# EAGLE schematic Shutdown Circuit (EAGLE 8.4.1)
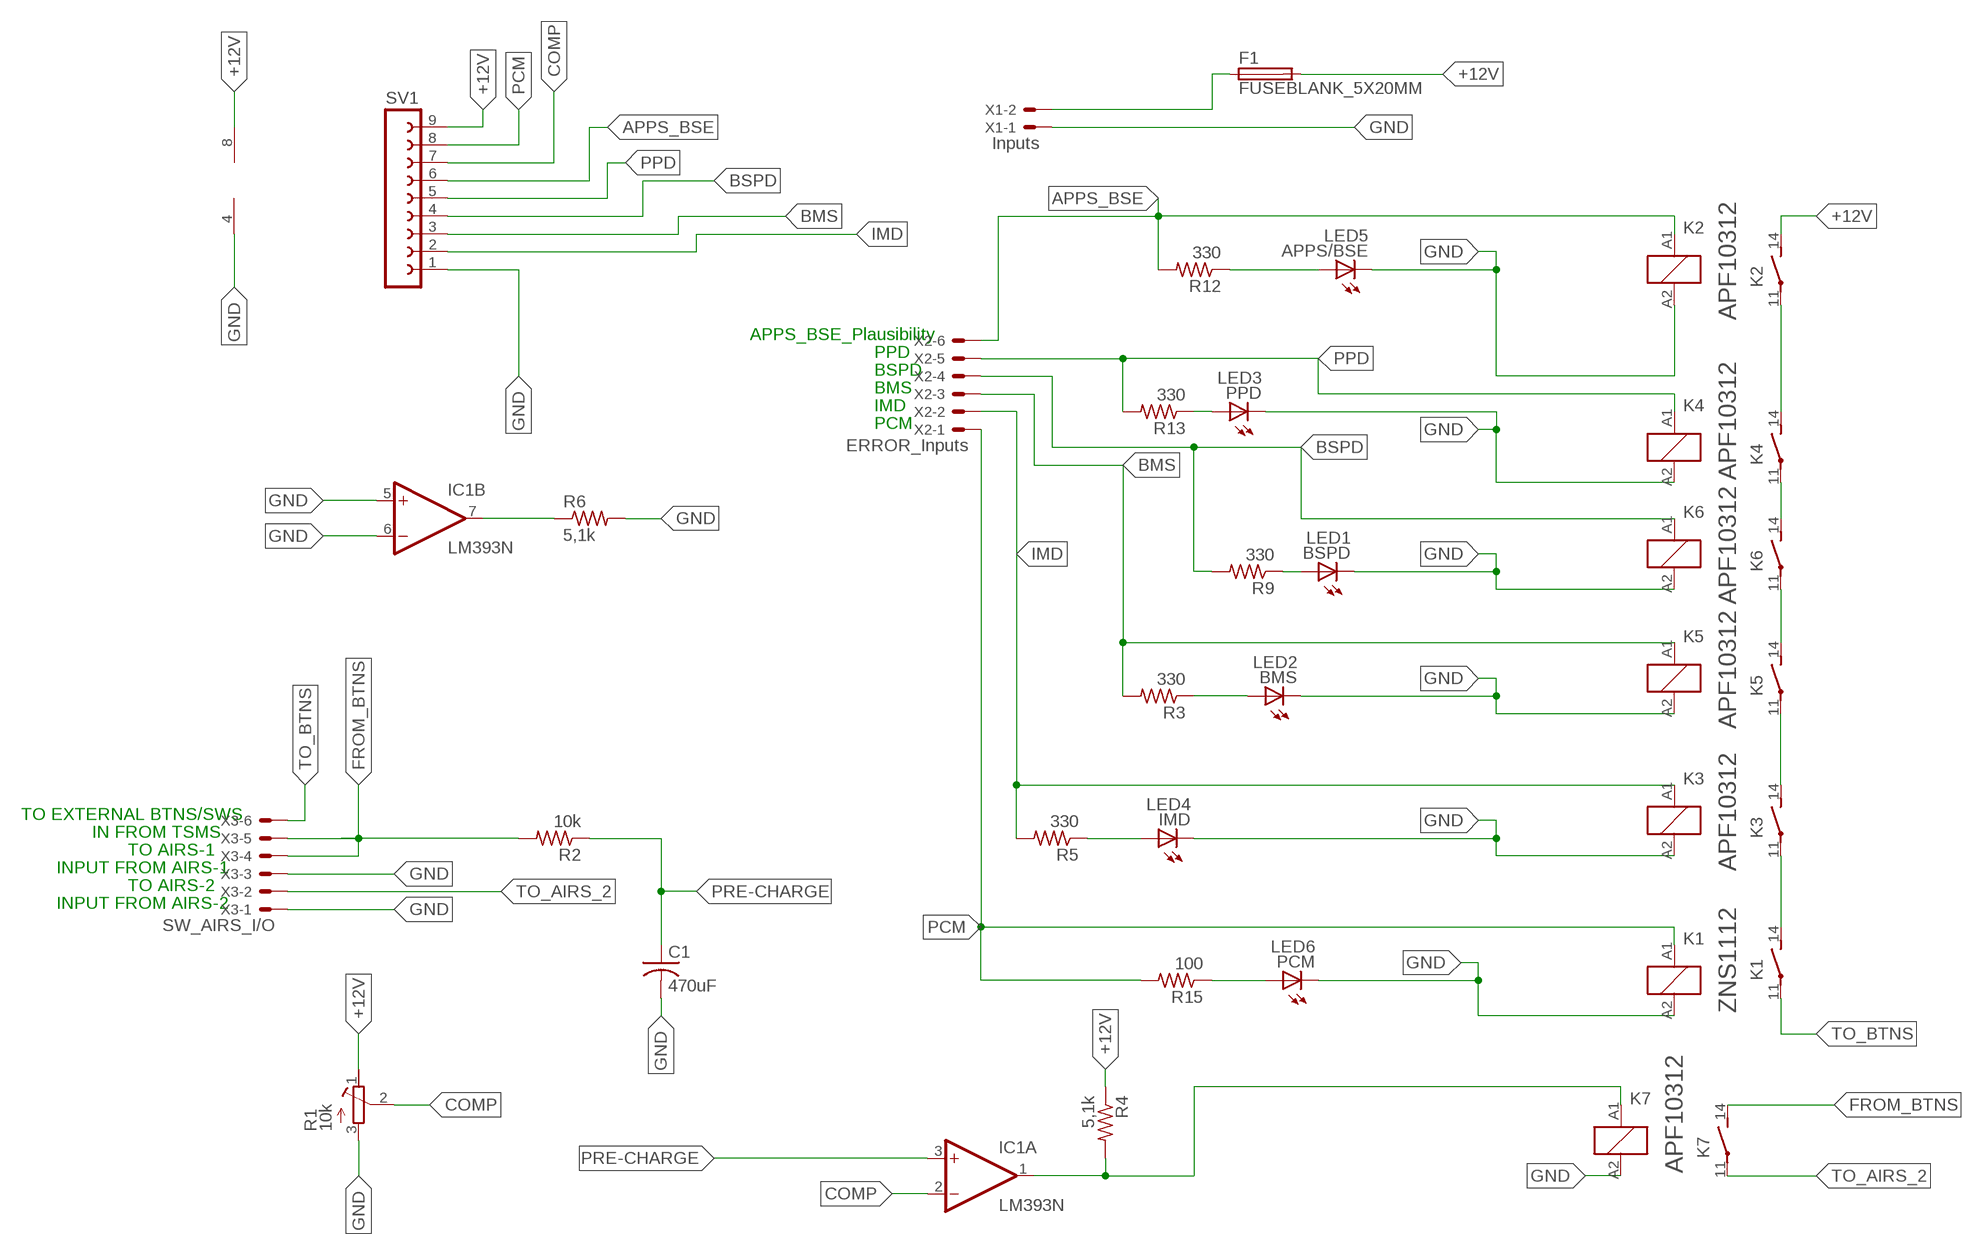
[diagram p0: schematic, sheet 1]

## Parts
APPS/BSE  LED5  LED3MM  [LED3MM]
BMS  LED2  LED3MM  [LED3MM]
BSPD  LED1  LED3MM  [LED3MM]
C1  470uF  C-US050-045X075  [C050-045X075]
F1  FUSEBLANK_5X20MM  [FUSE_HOLDER_5X20MM]
IC1  LM393N  [DIL08]
IMD  LED4  LED3MM  [LED3MM]
K1  ZNS1112  [ZN1]
K2  APF10312  SNR1  [SNR-V1]
K3  APF10312  SNR1  [SNR-V1]
K4  APF10312  SNR1  [SNR-V1]
K5  APF10312  SNR1  [SNR-V1]
K6  APF10312  SNR1  [SNR-V1]
K7  APF10312  SNR1  [SNR-V1]
PCM  LED6  LED3MM  [LED3MM]
PPD  LED3  LED3MM  [LED3MM]
R1  10k  R-TRIMM43P  [RTRIM43P]
R2  10k  R-US_0207/10  [0207/10]
R3  330  R-US_0207/10  [0207/10]
R4  5,1k  R-US_0207/10  [0207/10]
R5  330  R-US_0207/10  [0207/10]
R6  5,1k  R-US_0207/10  [0207/10]
R9  330  R-US_0207/10  [0207/10]
R12  330  R-US_0207/10  [0207/10]
R13  330  R-US_0207/10  [0207/10]
R15  100  R-US_0207/10  [0207/10]
SV1  FE09W  [FE09W]
X1  Inputs  22-23-2021  [22-23-2021]
X2  ERROR_Inputs  22-23-2061  [22-23-2061]
X3  SW_AIRS_I/O  22-23-2061  [22-23-2061]

## Nets
+12V: F1.2 IC1.8(P:V+) K2.14(2:S) R1.1(E) R4.1 SV1.9
APPS_BSE: K2.A1 R12.2 SV1.6 X2.6
BMS: K5.A1 R3.2 SV1.3 X2.3
BSPD: K6.A1 R9.2 SV1.4 X2.4
COMP: IC1.2(A:-IN) R1.2(S) SV1.7
FROM_BTNS: K7.14(2:S) R2.2 X3.4 X3.5
GND: APPS/BSE.K(C) BMS.K(C) BSPD.K(C) C1.2 IC1.4(P:V-) IC1.5(B:+IN) IC1.6(B:-IN) IMD.K(C) K1.A2 K2.A2 K3.A2 K4.A2 K5.A2 K6.A2 K7.A2 PCM.K(C) PPD.K(C) R1.3(A) R6.2 SV1.1 X1.1 X3.1 X3.3
IMD: K3.A1 R5.2 SV1.2 X2.2
N$1: IC1.1(A:OUT) K7.A1 R4.2
N$6: K2.11(2:P) K4.14(2:S)
N$7: K4.11(2:P) K6.14(2:S)
N$8: IC1.7(B:OUT) R6.1
N$9: K5.14(2:S) K6.11(2:P)
N$10: F1.1 X1.2
N$12: K3.14(2:S) K5.11(2:P)
N$13: K1.14(2:S) K3.11(2:P)
N$24: APPS/BSE.A R12.1
N$25: BSPD.A R9.1
N$29: PPD.A R13.1
N$31: BMS.A R3.1
N$33: IMD.A R5.1
N$35: PCM.A R15.1
PCM: K1.A1 R15.2 SV1.8 X2.1
PPD: K4.A1 R13.2 SV1.5 X2.5
PRE-CHARGE: C1.1 IC1.3(A:+IN) R2.1
TO_AIRS_2: K7.11(2:P) X3.2
TO_BTNS: K1.11(2:P) X3.6

## Notes on the sheet
- APPS_BSE_Plausibility
- PPD
- BSPD
- BMS
- IMD
- PCM
- TO EXTERNAL BTNS/SWS
- IN FROM TSMS
- TO AIRS-1
- INPUT FROM AIRS-1
- TO AIRS-2
- INPUT FROM AIRS-2

## Library data of the parts
APPS/BSE BMS BSPD IMD PCM PPD = led:LED: LED OSRAM: - CHIPLED LG R971, LG N971, LY N971, LG Q971, LY Q971, LO R971, LY R971 LH N974, LH R974 LS Q976, LO Q976, LY Q976 LO Q996 - Hyper CHIPLED LW Q18S LB Q993, LB Q99A, LB R99A - SideLED LS A670, LO A670, LY A670, LG A670, LP A670 LB A673, LV A673, LT A673, LW A673 LH A674 LY A675 LS A676, LA A676, LO A676, LY A676, LW A676 LS A679, LY A679, LG A679 - Hyper Micro SIDELED® LS Y876, LA Y876, LO Y876, LY Y876 LT Y87S - SmartLED LW L88C, LW L88S LB L89C, LB L89S, LG L890 LS L89K, LO L89K, LY L89K LS L896, LA L896, LO L896, LY L896 - TOPLED LS T670, LO T670, LY T670, LG T670, LP T670 LSG T670, LSP T670, LSY T670, LOP T670, LYG T670 LG T671, LOG T671, LSG T671 LB T673, LV T673, LT T673, LW T673 LH T674 LS T676, LA T676, LO T676, LY T676, LB T676, LH T676, LSB T676, LW T676 LB T67C, LV T67C, LT T67C, LS T67K, LO T67K, LY T67K, LW E67C LS E67B, LA E67B, LO E67B, LY E67B, LB E67C, LV E67C, LT E67C LW T67C LS T679, LY T679, LG T679 LS T770, LO T770, LY T770, LG T770, LP T770 LB T773, LV T773, LT T773, LW T773 LH T774 LS E675, LA E675, LY E675, LS T675 LS T776, LA T776, LO T776, LY T776, LB T776 LHGB T686 LT T68C, LB T68C - Hyper Mini TOPLED® LB M676 - Mini TOPLED Santana® LG M470 LS M47K, LO M47K, LY M47K Source: http://www.osram.convergy.de LUXEON: - LUMILED® LXK2-PW12-R00, LXK2-PW12-S00, LXK2-PW14-U00, LXK2-PW14-V00 LXK2-PM12-R00, LXK2-PM12-S00, LXK2-PM14-U00 LXK2-PE12-Q00, LXK2-PE12-R00, LXK2-PE12-S00, LXK2-PE14-T00, LXK2-PE14-U00 LXK2-PB12-K00, LXK2-PB12-L00, LXK2-PB12-M00, LXK2-PB14-N00, LXK2-PB14-P00, LXK2-PB14-Q00 LXK2-PR12-L00, LXK2-PR12-M00, LXK2-PR14-Q00, LXK2-PR14-R00 LXK2-PD12-Q00, LXK2-PD12-R00, LXK2-PD12-S00 LXK2-PH12-R00, LXK2-PH12-S00 LXK2-PL12-P00, LXK2-PL12-Q00, LXK2-PL12-R00 Source: www.luxeon.com KINGBRIGHT: KA-3528ASYC Source: www.kingbright.com; MF: VISHAY/TELEFUNKEN; MPN: TLCR5800; OC_NEWARK: 22H1217
C1 = resistor:C-US: CAPACITOR, American symbol; MPN: MAL213631471E3; OC_NEWARK: 14AC4375
F1 = fuse:FUSE: Fuse; OC_FARNELL: unknown; OC_NEWARK: unknown
IC1 = linear:LM393: COMPARATOR; MF: TEXAS INSTRUMENTS; MPN: LM393P; OC_NEWARK: 06F9461
K1 = relay:ZNS1*: Miniature Power PCB Relay SCHRACK 1pole 10 A Source: http://www.schrack.com/.. 5847.pdf; OC_FARNELL: unknown; OC_NEWARK: unknown
K2-K7 = relay:SN*: Slim PCB Relay 1 pole 6 A SCHRACK Source: http://www.schrack.com/.. 5815.pdf; OC_FARNELL: unknown; OC_NEWARK: unknown
R1 = rcl:R-TRIMM: Trimm resistor; MF: FARNELL; MPN: MF50 10K; OC_NEWARK: 38K5141; SPICEMODEL: X; SPICEPREFIXL: POT
R2 = resistor:R-US_: RESISTOR, American symbol; MF: FARNELL; MPN: MCF 0.25W 10K; OC_NEWARK: 38K0328
R3-R6 R9 R12 R13 R15 = resistor:R-US_: RESISTOR, American symbol; OC_NEWARK: unknown
SV1 = con-lsta:FE09W: FEMALE HEADER; OC_FARNELL: unknown; OC_NEWARK: unknown
X1 = con-molex:22-23-2021: .100" (2.54mm) Center Header - 2 Pin; MF: MOLEX; MPN: 22-23-2021; OC_FARNELL: 1462926; OC_NEWARK: 25C3832
X2 X3 = con-molex:22-23-2061: .100" (2.54mm) Center Header - 6 Pin; MF: MOLEX; MPN: 22-23-2061; OC_FARNELL: 1462922; OC_NEWARK: 27C1933